# EAGLE design board_final (EAGLE 7.6.0)
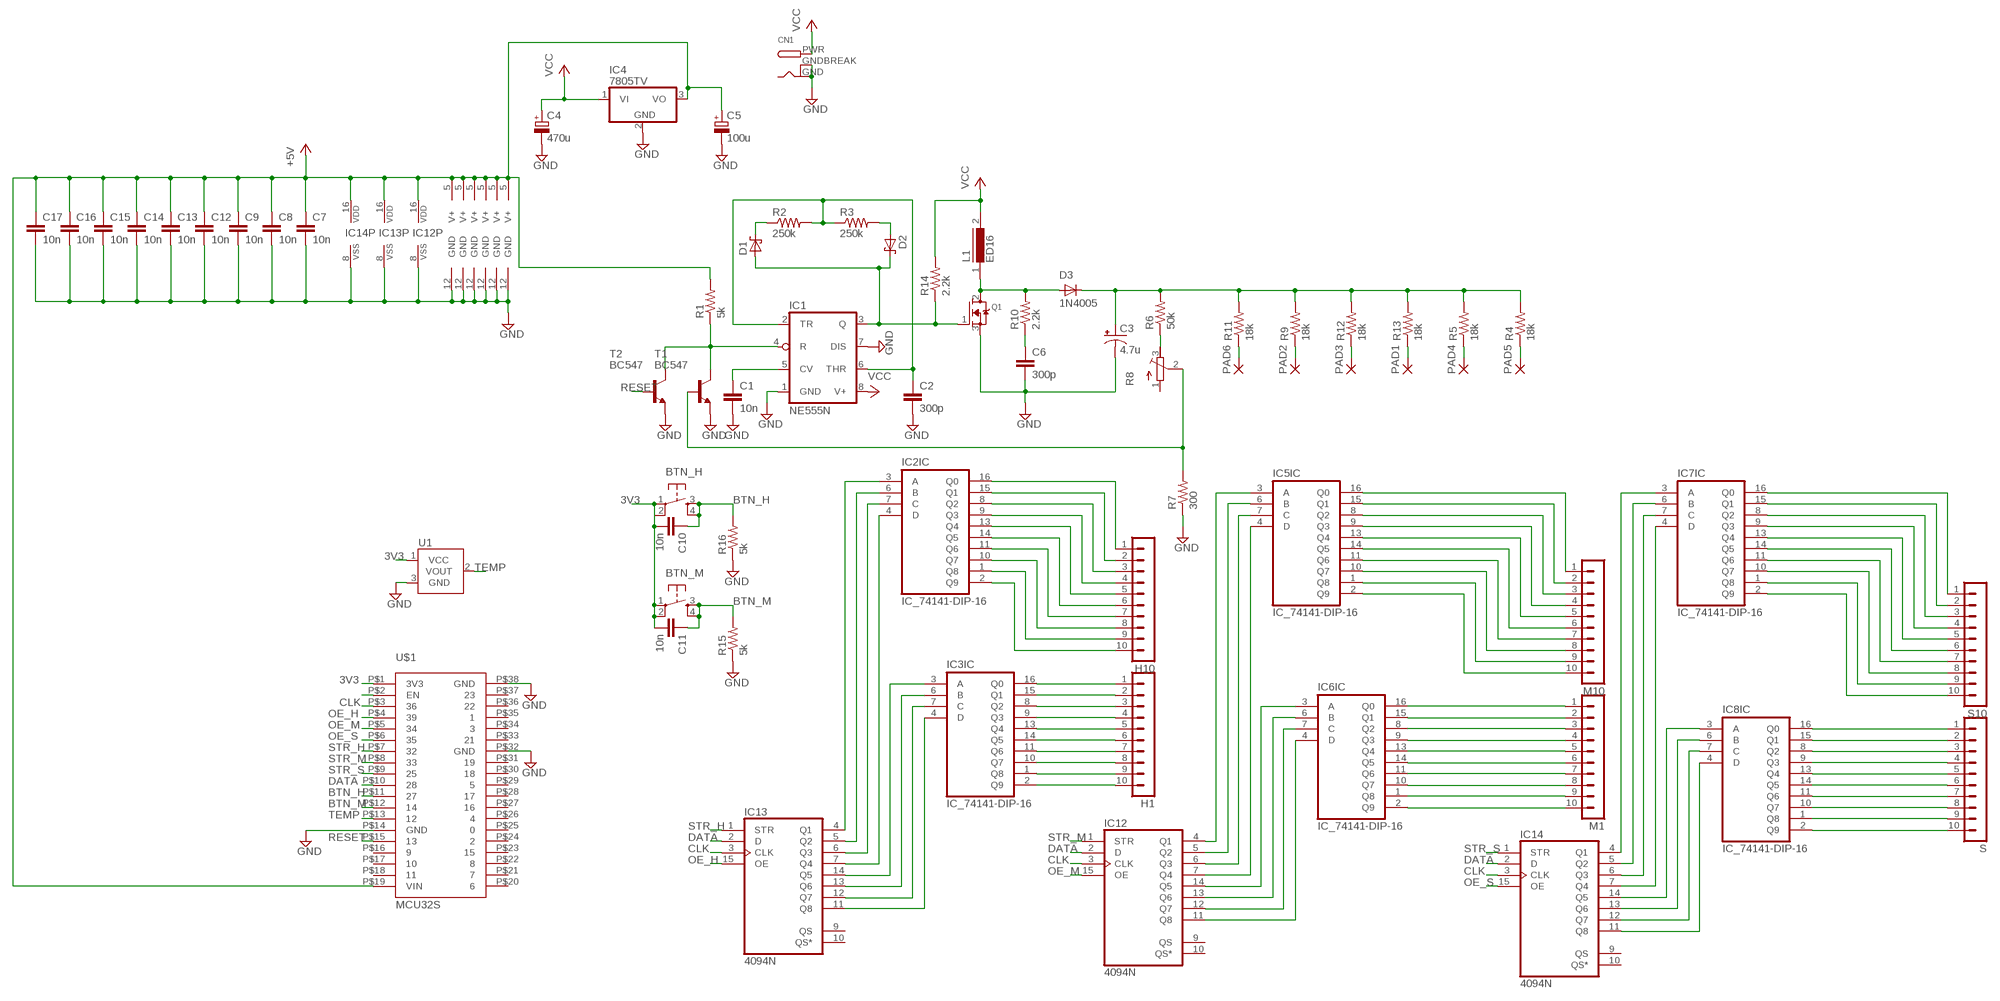
[diagram p0: schematic, sheet 1]

## Parts
BTN_H  TAC_SWITCHPTH  [TACTILE-PTH]
BTN_M  TAC_SWITCHPTH  [TACTILE-PTH]
C1  10n  C-EU050-030X075  [C050-030X075]
C2  300p  C-EU050-030X075  [C050-030X075]
C3  4.7u  CPOL-USE3.5-10  [E3,5-10]
C4  470u  CPOL-EUE5-8.5  [E5-8,5]
C5  100u  CPOL-EUE5-8.5  [E5-8,5]
C6  300p  C-EU050-030X075  [C050-030X075]
C7  10n  C-EU050-030X075  [C050-030X075]
C8  10n  C-EU050-030X075  [C050-030X075]
C9  10n  C-EU050-030X075  [C050-030X075]
C10  10n  C-EU050-030X075  [C050-030X075]
C11  10n  C-EU050-030X075  [C050-030X075]
C12  10n  C-EU050-030X075  [C050-030X075]
C13  10n  C-EU050-030X075  [C050-030X075]
C14  10n  C-EU050-030X075  [C050-030X075]
C15  10n  C-EU050-030X075  [C050-030X075]
C16  10n  C-EU050-030X075  [C050-030X075]
C17  10n  C-EU050-030X075  [C050-030X075]
CN1  DCBARRELPTH  [DCJACK_2MM_PTH]
D1  SCHOTTKY-DIODEF126Z12  [F126Z12]
D2  SCHOTTKY-DIODEF126Z12  [F126Z12]
D3  1N4005  [DO41-10]
H1  MA10-1  [MA10-1]
H10  MA10-1  [MA10-1]
IC1  NE555N  [DIL08]
IC2  IC_74141-DIP-16  [DIL16]
IC3  IC_74141-DIP-16  [DIL16]
IC4  7805TV  [TO220V]
IC5  IC_74141-DIP-16  [DIL16]
IC6  IC_74141-DIP-16  [DIL16]
IC7  IC_74141-DIP-16  [DIL16]
IC8  IC_74141-DIP-16  [DIL16]
IC12  4094N  [DIL16]
IC13  4094N  [DIL16]
IC14  4094N  [DIL16]
L1  ED16  [ED16]
M1  MA10-1  [MA10-1]
M10  MA10-1  [MA10-1]
PAD1  3,17/1,3  [3,17/1,3]
PAD2  3,17/1,3  [3,17/1,3]
PAD3  3,17/1,3  [3,17/1,3]
PAD4  3,17/1,3  [3,17/1,3]
PAD5  3,17/1,3  [3,17/1,3]
PAD6  3,17/1,3  [3,17/1,3]
Q1  MOSFET-NGDS_TO220V  [TO220V]
R1  5k  R-US_0207/10  [0207/10]
R2  250k  R-US_0207/10  [0207/10]
R3  250k  R-US_0207/10  [0207/10]
R4  18k  R-US_0207/10  [0207/10]
R5  18k  R-US_0207/10  [0207/10]
R6  50k  R-US_0207/10  [0207/10]
R7  300  R-US_0207/10  [0207/10]
R8  R-TRIMM3296W  [RTRIM3296W]
R9  18k  R-US_0207/10  [0207/10]
R10  2.2k  R-US_0207/10  [0207/10]
R11  18k  R-US_0207/10  [0207/10]
R12  18k  R-US_0207/10  [0207/10]
R13  18k  R-US_0207/10  [0207/10]
R14  2.2k  R-US_0207/10  [0207/10]
R15  5k  R-US_0207/10  [0207/10]
R16  5k  R-US_0207/10  [0207/10]
S  MA10-1  [MA10-1]
S10  MA10-1  [MA10-1]
T1  BC547  [TO92]
T2  BC547  [TO92]
U1  TMP36GT9  [TO-92]
U$1  MCU32S  [NODEMCU32S]

## Nets
3V3: BTN_H.1 BTN_H.2 BTN_M.1 BTN_M.2 C10.2 C11.2 U1.1(VCC) U$1.P$1(3V3)
BTN_H: BTN_H.3 BTN_H.4 C10.1 R16.2 U$1.P$11
BTN_M: BTN_M.3 BTN_M.4 C11.1 R15.2 U$1.P$12
CLK: IC12.3(CLK) IC13.3(CLK) IC14.3(CLK) U$1.P$3
DATA: IC12.2(D) IC13.2(D) IC14.2(D) U$1.P$10
GND: C1.2 C2.2 C3.- C4.- C5.- C6.2 C7.2 C8.2 C9.2 C12.2 C13.2 C14.2 C15.2 C16.2 C17.2 CN1.GND CN1.GNDBREAK IC1.1(GND) IC1.7(DIS) IC2.12(SUPPLY:GND) IC3.12(SUPPLY:GND) IC4.2(GND) IC5.12(SUPPLY:GND) IC6.12(SUPPLY:GND) IC7.12(SUPPLY:GND) IC8.12(SUPPLY:GND) IC12.8(VSS) IC13.8(VSS) IC14.8(VSS) Q1.3(S) R7.1 R15.1 R16.1 T1.1(E) T2.1(E) U1.3(GND) U$1.P$14(GND) U$1.P$32(GND) U$1.P$38(GND)
N$1: C1.1 IC1.5(CV)
N$2: C2.1 IC1.2(TR) IC1.6(THR) R2.2 R3.1
N$3: C3.+ D3.C R4.2 R5.2 R6.2 R9.2 R11.2 R12.2 R13.2
N$4: D1.A D2.C IC1.3(Q) Q1.1(G) R14.1
N$5: IC1.4(R) R1.1 T1.3(C) T2.3(C)
N$6: H10.1 IC2.16(IC:Q0)
N$7: D2.A R3.2
N$8: D1.C R2.1
N$9: IC2.3(IC:A) IC13.4(Q1)
N$10: D3.A L1.1 Q1.2(D) R10.2
N$11: H10.2 IC2.15(IC:Q1)
N$12: H10.3 IC2.8(IC:Q2)
N$13: H10.4 IC2.9(IC:Q3)
N$14: H10.5 IC2.13(IC:Q4)
N$15: H10.6 IC2.14(IC:Q5)
N$16: H10.7 IC2.11(IC:Q6)
N$17: H10.8 IC2.10(IC:Q7)
N$18: H10.9 IC2.1(IC:Q8)
N$19: H10.10 IC2.2(IC:Q9)
N$20: PAD6.1(P) R11.1
N$21: IC2.7(IC:C) IC13.6(Q3)
N$22: IC2.6(IC:B) IC13.5(Q2)
N$23: IC2.4(IC:D) IC13.7(Q4)
N$24: H1.1 IC3.16(IC:Q0)
N$25: H1.2 IC3.15(IC:Q1)
N$26: H1.3 IC3.8(IC:Q2)
N$27: C6.1 R10.1
N$28: H1.4 IC3.9(IC:Q3)
N$29: H1.5 IC3.13(IC:Q4)
N$30: H1.6 IC3.14(IC:Q5)
N$31: H1.7 IC3.11(IC:Q6)
N$32: R6.1 R8.3(E)
N$33: R7.2 R8.2(S) T1.2(B)
N$34: H1.8 IC3.10(IC:Q7)
N$35: H1.9 IC3.1(IC:Q8)
N$36: H1.10 IC3.2(IC:Q9)
N$37: IC3.7(IC:C) IC13.12(Q7)
N$38: IC3.6(IC:B) IC13.13(Q6)
N$39: IC3.4(IC:D) IC13.11(Q8)
N$40: PAD2.1(P) R9.1
N$41: IC3.3(IC:A) IC13.14(Q5)
N$42: IC6.2(IC:Q9) M1.10
N$43: IC6.1(IC:Q8) M1.9
N$44: IC6.10(IC:Q7) M1.8
N$45: IC6.11(IC:Q6) M1.7
N$46: IC6.14(IC:Q5) M1.6
N$47: IC6.13(IC:Q4) M1.5
N$48: IC6.9(IC:Q3) M1.4
N$49: IC6.8(IC:Q2) M1.3
N$50: IC6.15(IC:Q1) M1.2
N$51: IC6.16(IC:Q0) M1.1
N$52: IC5.7(IC:C) IC12.6(Q3)
N$53: IC5.6(IC:B) IC12.5(Q2)
N$54: IC5.4(IC:D) IC12.7(Q4)
N$55: PAD3.1(P) R12.1
N$56: IC5.3(IC:A) IC12.4(Q1)
N$57: IC5.16(IC:Q0) M10.1
N$58: IC5.15(IC:Q1) M10.2
N$59: IC5.8(IC:Q2) M10.3
N$60: IC5.9(IC:Q3) M10.4
N$61: IC5.13(IC:Q4) M10.5
N$62: IC5.14(IC:Q5) M10.6
N$63: IC5.11(IC:Q6) M10.7
N$64: IC5.10(IC:Q7) M10.8
N$65: IC5.1(IC:Q8) M10.9
N$66: IC5.2(IC:Q9) M10.10
N$67: IC6.6(IC:B) IC12.13(Q6)
N$68: IC8.16(IC:Q0) S.1
N$69: IC8.15(IC:Q1) S.2
N$70: PAD1.1(P) R13.1
N$71: IC6.3(IC:A) IC12.14(Q5)
N$72: IC7.3(IC:A) IC14.4(Q1)
N$73: IC8.8(IC:Q2) S.3
N$74: IC8.9(IC:Q3) S.4
N$75: IC8.13(IC:Q4) S.5
N$76: IC8.14(IC:Q5) S.6
N$77: IC8.11(IC:Q6) S.7
N$78: IC8.10(IC:Q7) S.8
N$79: IC8.2(IC:Q9) S.10
N$80: IC8.1(IC:Q8) S.9
N$81: IC7.16(IC:Q0) S10.1
N$82: IC7.6(IC:B) IC14.5(Q2)
N$83: IC7.7(IC:C) IC14.6(Q3)
N$84: IC7.4(IC:D) IC14.7(Q4)
N$85: PAD4.1(P) R5.1
N$86: IC8.3(IC:A) IC14.14(Q5)
N$87: IC8.6(IC:B) IC14.13(Q6)
N$88: IC7.15(IC:Q1) S10.2
N$89: IC7.8(IC:Q2) S10.3
N$90: IC7.9(IC:Q3) S10.4
N$91: IC7.13(IC:Q4) S10.5
N$92: IC7.14(IC:Q5) S10.6
N$93: IC7.11(IC:Q6) S10.7
N$94: IC7.10(IC:Q7) S10.8
N$95: IC7.1(IC:Q8) S10.9
N$96: IC7.2(IC:Q9) S10.10
N$97: IC8.7(IC:C) IC14.12(Q7)
N$98: IC8.4(IC:D) IC14.11(Q8)
N$99: PAD5.1(P) R4.1
N$100: IC6.7(IC:C) IC12.12(Q7)
N$101: U$1.P$2(EN)
N$102: IC6.4(IC:D) IC12.11(Q8)
OE_H: IC13.15(OE) U$1.P$4
OE_M: IC12.15(OE) U$1.P$5
OE_S: IC14.15(OE) U$1.P$6
RESET: T2.2(B) U$1.P$15
STR_H: IC13.1(STR) U$1.P$7
STR_M: IC12.1(STR) U$1.P$8
STR_S: IC14.1(STR) U$1.P$9
TEMP: U1.2(VOUT) U$1.P$13
V+: C5.+ C7.1 C8.1 C9.1 C12.1 C13.1 C14.1 C15.1 C16.1 C17.1 IC2.5(SUPPLY:V+) IC3.5(SUPPLY:V+) IC4.3(VO) IC5.5(SUPPLY:V+) IC6.5(SUPPLY:V+) IC7.5(SUPPLY:V+) IC8.5(SUPPLY:V+) IC12.16(VDD) IC13.16(VDD) IC14.16(VDD) R1.2 U$1.P$19(VIN) ; supply symbol labelled +5V
VCC: C4.+ CN1.PWR IC1.8(V+) IC4.1(VI) L1.2 R14.2
Unconnected: IC12.9(QS) IC12.10(QS*) IC13.9(QS) IC13.10(QS*) IC14.9(QS) IC14.10(QS*) R8.1(A) U$1.P$16 U$1.P$17 U$1.P$18 U$1.P$20 U$1.P$21 U$1.P$22 U$1.P$23 U$1.P$24 U$1.P$25 U$1.P$26 U$1.P$27 U$1.P$28 U$1.P$29 U$1.P$30 U$1.P$31 U$1.P$33 U$1.P$34 U$1.P$35 U$1.P$36 U$1.P$37

## Library data of the parts
BTN_H BTN_M = SparkFun:TAC_SWITCH: Momentary Switch Button commonly used for reset or general input. Spark Fun Electronics SKU : COM-00097
C1 C2 C6-C17 = rcl:C-EU: CAPACITOR, European symbol
C3 = adafruit:CPOL-US: POLARIZED CAPACITOR, American symbol
C4 C5 = rcl:CPOL-EU: POLARIZED CAPACITOR, European symbol
CN1 = adafruit:DCBARREL: 2.0mm DC Barrel Jack DCJACK_2MM_PTH - Through Hole Jack (4UConnector: 05537)
D1 D2 = adafruit:SCHOTTKY-DIODE: Schottky Diode
D3 = diode:1N4005
H1 H10 M1 M10 S S10 = con-lstb:MA10-1: PIN HEADER; OC_FARNELL: unknown; OC_NEWARK: unknown
IC1 = linear:*555: TIMER
IC2 IC3 IC5-IC8 = dp_devices:IC_74141: BCD to decimal decoder
IC4 = linear:78*: Positive VOLTAGE REGULATOR Source: http://cache.national.com/ds/LM/LM78L05.pdf http://www.fairchildsemi.com/ds/LM/LM7805.pdf
IC12-IC14 = 40xx:4094: 8-stage SHIFT/STORE REGISTER, tri-state
L1 = inductors:ED16: INDUCTOR
PAD1-PAD6 = wirepad:3,17/1,3: THROUGH-HOLE PAD
Q1 = adafruit:MOSFET-N: N-Channel Mosfet 2N7002E - 60V 260mA SOT23 [Digikey: 2N7002ET1GOSTR-ND] - REEL BSH103 - 30V 850mA SOT23 [Digikey: 568-5013-1-ND]
R1-R7 R9-R16 = rcl:R-US_: RESISTOR, American symbol
R8 = resistor:R-TRIMM: Trimm resistor
T1 T2 = transistor:BC547: NPN TRANSISTOR
U1 = SparkFun:TMP36
U$1 = nodeMCU:MCU32S

## Board
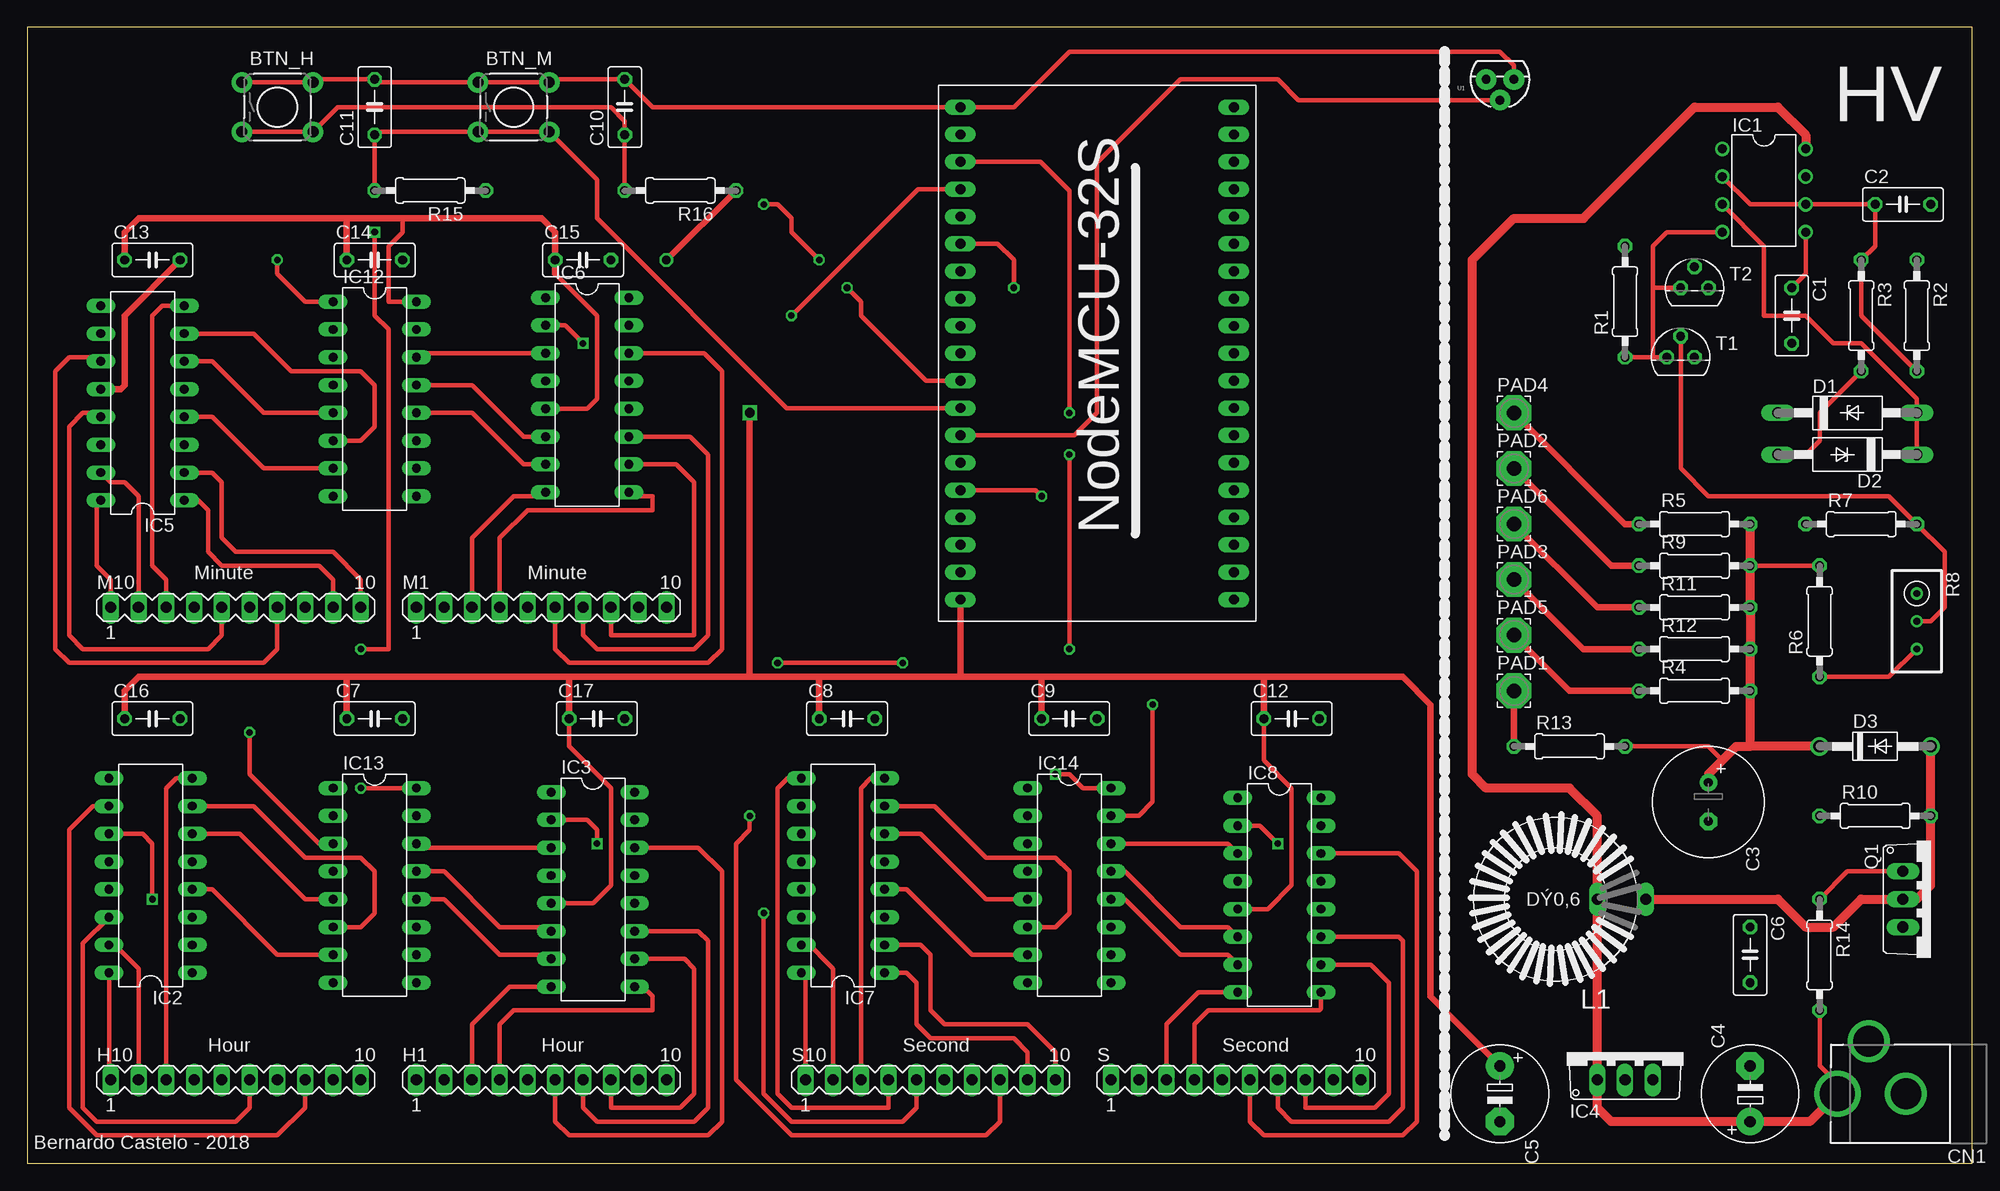
[diagram p1: board, top side]
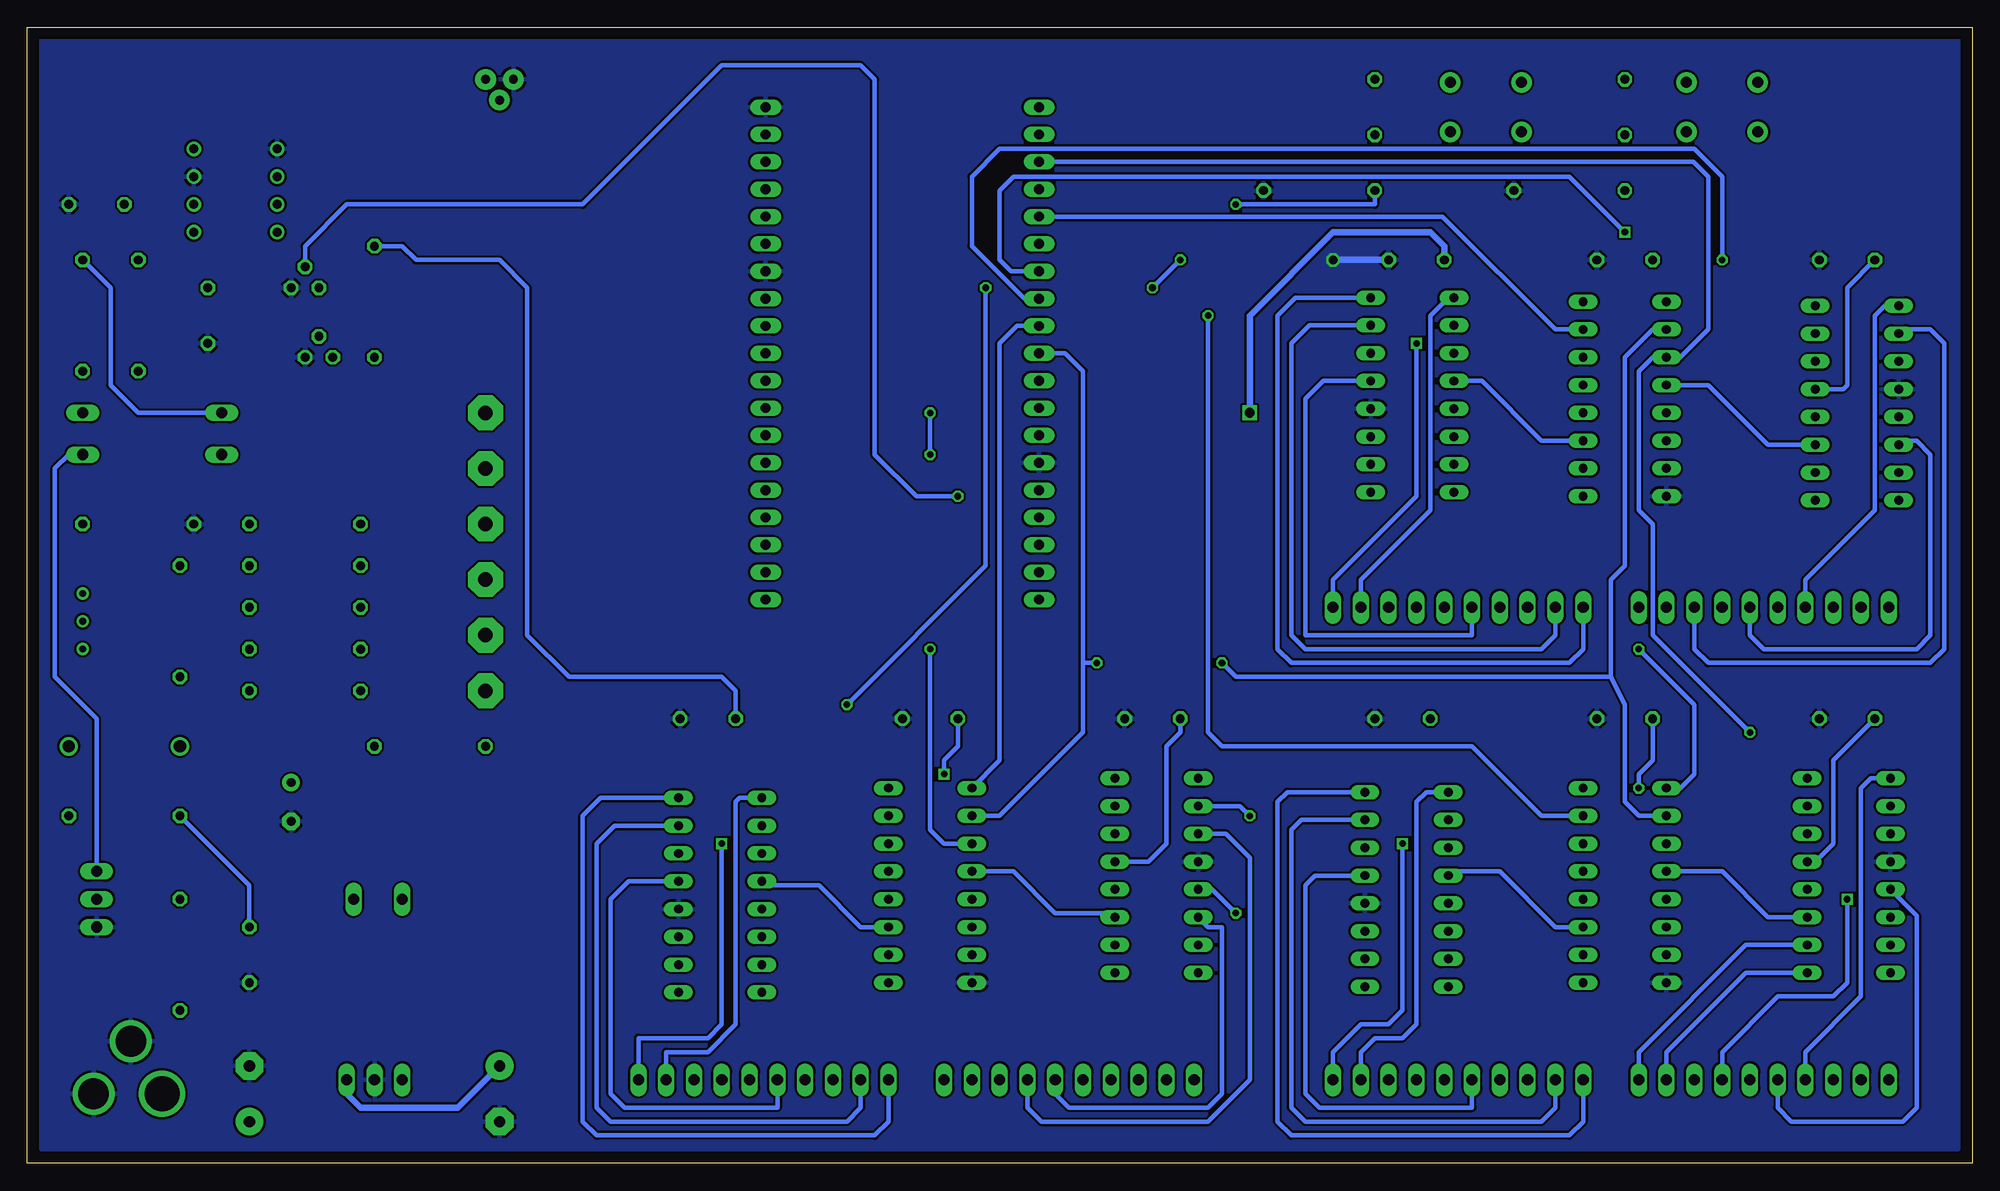
[diagram p2: board, bottom side, seen from below]

Size 177.78 x 103.81 mm. Coordinates in mm from the lower left corner, seen from the top.
Outline: 0,0 177.78,0 177.78,103.81 0,103.81 0,0
Copper layers (1*16): Top 0.035mm / dielectric 1.5mm / Bottom 0.035mm
Design rules "default *": minimum track width 3.5mil, minimum drill 0.2mm, track to track 8mil, track to pad 8mil, pad to pad 8mil, via to via 8mil, smd to smd 8mil, copper to edge 40mil, drill to drill 0.2mm, minimum pad ring 10mil, minimum via ring 8mil, stop-mask expansion 4mil, vias tented up to drill 0mil, thermal gap 10mil

### Footprints (pad centres in the part's own frame; a part is rotated, then mirrored left to right if it is on the bottom)
TACTILE-PTH = drill 1.016 pad 1.88: 1 -3.251,2.261; 2 3.251,2.261; 3 -3.251,-2.261; 4 3.251,-2.261
C050-030X075 = drill 0.813 octagon: 1 -2.54,0; 2 2.54,0
E3,5-10 = drill 0.813 pad 1.6: + -1.778,0 | drill 0.813 pad 1.6 octagon: - 1.778,0
E5-8,5 = drill 1.016 pad 2.54: + -2.54,0 | drill 1.016 pad 2.54 octagon: - 2.54,0
DCJACK_2MM_PTH = drill 2.8: GND 0,7.35; GNDBREAK 4.8,10.75 | drill 3.2: PWR 0,13.6
F126Z12 = drill 1.016 long: A 6.35,0; C -6.35,0
DO41-10 = drill 1.118: A 5.08,0; C -5.08,0
MA10-1 = drill 1.016 long: 1 -11.43,0; 2 -8.89,0; 3 -6.35,0; 4 -3.81,0; 5 -1.27,0; 6 1.27,0; 7 3.81,0; 8 6.35,0; 9 8.89,0; 10 11.43,0
DIL08 = drill 0.813 pad 1.27: 1 -3.81,-3.81; 2 -1.27,-3.81; 3 1.27,-3.81; 4 3.81,-3.81; 5 3.81,3.81; 6 1.27,3.81; 7 -1.27,3.81; 8 -3.81,3.81
DIL16 = drill 0.813 long: 1 -8.89,-3.81; 2 -6.35,-3.81; 3 -3.81,-3.81; 4 -1.27,-3.81; 5 1.27,-3.81; 6 3.81,-3.81; 7 6.35,-3.81; 8 8.89,-3.81; 9 8.89,3.81; 10 6.35,3.81; 11 3.81,3.81; 12 1.27,3.81; 13 -1.27,3.81; 14 -3.81,3.81; 15 -6.35,3.81; 16 -8.89,3.81
TO220V = drill 1.016 long: 1 -2.54,-2.54; 2 0,-2.54; 3 2.54,-2.54
ED16 = drill 1.016 long: 1 -8.255,0; 2 -3.81,0
3,17/1,3 = drill 1.321 pad 3.175 octagon: 1 0,0
0207/10 = drill 0.813 octagon: 1 -5.08,0; 2 5.08,0
RTRIM3296W = drill 0.61: 1 0,-2.54; 2 0,0; 3 0,2.54
TO92 = drill 0.813 octagon: 1 1.27,0; 2 0,1.905; 3 -1.27,0
TO-92 = drill 0.813 pad 1.88: 1 -1.27,0; 2 0,1.905; 3 1.27,0
NODEMCU32S = drill 0.9 pad 1.422 long: P$1 -12.5,0; P$2 -12.5,-2.5; P$3 -12.5,-5; P$4 -12.5,-7.5; P$5 -12.5,-10; P$6 -12.5,-12.5; P$7 -12.5,-15; P$8 -12.5,-17.5; P$9 -12.5,-20; P$10 -12.5,-22.5; P$11 -12.5,-25; P$12 -12.5,-27.5; P$13 -12.5,-30; P$14 -12.5,-32.5; P$15 -12.5,-35; P$16 -12.5,-37.5; P$17 -12.5,-40; P$18 -12.5,-42.5; P$19 -12.5,-45; P$20 12.5,-45; P$21 12.5,-42.5; P$22 12.5,-40; P$23 12.5,-37.5; P$24 12.5,-35; P$25 12.5,-32.5; P$26 12.5,-30; P$27 12.5,-27.5; P$28 12.5,-25; P$29 12.5,-22.5; P$30 12.5,-20; P$31 12.5,-17.5; P$32 12.5,-15; P$33 12.5,-12.5; P$34 12.5,-10; P$35 12.5,-7.5; P$36 12.5,-5; P$37 12.5,-2.5; P$38 12.5,0

### Placement (x,y rotation side)
BTN_H  22.86,96.52 0 top
BTN_M  44.45,96.52 0 top
C1  161.29,77.47 270 top
C2  171.45,87.63 0 top
C3  153.67,33.02 270 top
C4  157.48,6.35 90 top
C5  134.62,6.35 270 top
C6  157.48,19.05 270 top
C7  31.75,40.64 0 top
C8  74.93,40.64 0 top
C9  95.25,40.64 0 top
C10  54.61,96.52 90 top
C11  31.75,96.52 90 top
C12  115.57,40.64 0 top
C13  11.43,82.55 0 top
C14  31.75,82.55 0 top
C15  50.8,82.55 0 top
C16  11.43,40.64 0 top
C17  52.07,40.64 0 top
CN1  179.07,6.35 90 top
D1  166.37,68.58 0 top
D2  166.37,64.77 180 top
D3  168.91,38.1 0 top
H1  46.99,7.62 0 top
H10  19.05,7.62 0 top
IC1  158.75,88.9 270 top
IC2  11.28,26.3 90 top
IC3  51.7,25.03 270 top
IC4  146.05,10.16 0 top
IC5  10.53,69.48 90 top
IC6  51.17,70.22 270 top
IC7  74.56,26.3 90 top
IC8  114.45,24.5 270 top
IC12  31.75,69.85 270 top
IC13  31.75,25.4 270 top
IC14  95.25,25.4 270 top
L1  139.7,24.13 180 top
M1  46.99,50.8 0 top
M10  19.05,50.8 0 top
PAD1  135.89,43.18 0 top
PAD2  135.89,63.5 0 top
PAD3  135.89,53.34 0 top
PAD4  135.89,68.58 0 top
PAD5  135.89,48.26 0 top
PAD6  135.89,58.42 0 top
Q1  173.99,24.13 270 top
R1  146.05,78.74 90 top
R2  172.72,77.47 270 top
R3  167.64,77.47 270 top
R4  152.4,43.18 0 top
R5  152.4,58.42 0 top
R6  163.83,49.53 90 top
R7  167.64,58.42 0 top
R8  172.72,49.53 180 top
R9  152.4,54.61 0 top
R10  168.91,31.75 0 top
R11  152.4,50.8 0 top
R12  152.4,46.99 0 top
R13  140.97,38.1 0 top
R14  163.83,19.05 270 top
R15  36.83,88.9 180 top
R16  59.69,88.9 180 top
S  110.49,7.62 0 top
S10  82.55,7.62 0 top
T1  151.13,73.66 0 top
T2  152.4,80.01 0 top
U1  134.62,99.06 180 top
U$1  97.79,96.52 0 top

### Tracks (layer width: path | path; a pad name or v marks a point on that pad's centre or on a via)
3V3
  Top 0.406: BTN_H.1 BTN_H.2 26.39,99.06 C11.2 32.03,98.78 BTN_M.1 BTN_M.2 47.98,99.06 C10.2 57.15,96.52 U$1.P$1 90.17,96.52 95.25,101.6 134.62,101.6 135.89,100.33 U1.1
BTN_H  (via drill 0.6)
  Top 0.406: BTN_H.3 BTN_H.4 28.37,96.52 53.34,96.52 54.61,95.25 C10.1 R16.2 | v67.31,87.63 68.58,87.63 69.85,86.36 69.85,85.09 v72.39,82.55 | v74.93,80.01 76.2,78.74 76.2,77.47 82.15,71.52 U$1.P$11
  Bottom 0.406: R16.2 54.61,87.63 v67.31,87.63 | v72.39,82.55 v74.93,80.01
BTN_M
  Top 0.406: R15.2 C11.1 32.03,94.26 BTN_M.3 BTN_M.4 52.07,89.89 52.07,86.36 69.41,69.02 U$1.P$12
CLK  (via drill 0.6)
  Top 0.406: v95.25,46.99 v95.25,64.77 | v95.25,68.58 95.25,88.9 92.63,91.52 U$1.P$3 | IC13.3 26.67,29.21 20.32,35.56 v20.32,39.37
  Bottom 0.406: U$1.P$3 25.48,91.52 24.13,90.17 24.13,76.2 26.67,73.66 IC12.3 29.21,73.66 30.48,72.39 30.48,59.69 29.21,58.42 29.21,48.26 v20.32,39.37 | IC14.3 93.98,29.21 95.25,30.48 v95.25,46.99 | v95.25,64.77 v95.25,68.58
DATA  (via drill 0.6)
  Top 0.406: v80.01,45.72 v68.58,45.72
  Bottom 0.406: IC12.2 29.21,76.2 31.75,73.66 31.75,54.61 33.02,53.34 33.02,44.45 | IC13.2 30.48,31.75 31.75,33.02 31.75,41.91 33.02,44.45 | 33.02,44.45 67.31,44.45 v68.58,45.72 | IC14.2 88.9,31.75 81.28,39.37 81.28,45.72 | 81.28,45.72 81.28,72.39 82.91,74.02 U$1.P$10 | 81.28,45.72 v80.01,45.72
GND  (via drill 0.8)
  Top 0.61: v58.42,82.55 R16.1 | IC5.12 8.52,70.75 8.89,71.12 8.89,77.47 C13.2
  Bottom 0.61: C15.2 v58.42,82.55
  pour Bottom: 1.27,102.87 176.53,102.87 176.53,1.27 1.27,1.27
N$1
  Top 0.406: C1.1 162.56,81.28 IC1.5
N$2
  Top 0.406: IC1.2 157.48,87.63 IC1.6 C2.1 168.91,83.82 R3.1 167.64,77.47 R2.2
N$3
  Top 0.406: R6.2 R9.2 | 154.94,36.83 153.67,38.1 R13.2
  Top 0.813: D3.C 157.48,38.1 | C3.+ 153.67,35.56 154.94,36.83 156.21,38.1 157.48,38.1 | 157.48,38.1 R4.2 R12.2 R11.2 R9.2 R5.2
N$4
  Top 0.406: R14.1 166.37,26.67 Q1.1 | D2.C D1.A 172.72,69.85 167.64,74.93 165.1,74.93 162.56,77.47 158.75,77.47 158.75,83.82 IC1.3
  Bottom 0.406: Q1.1 171.45,40.64 175.26,44.45 175.26,63.5 173.99,64.77 D2.C
N$5
  Top 0.406: T1.3 148.59,73.66 | 148.59,73.66 R1.1 | IC1.4 149.86,85.09 148.59,83.82 148.59,80.01 | 148.59,80.01 148.59,73.66 | T2.3 148.59,80.01
N$6
  Top 0.406: 7.62,17.25 IC2.16 7.47,7.62 H10.1
N$7
  Top 0.406: R3.2 163.83,68.58 163.83,66.04 162.56,64.77 D2.A
N$8
  Bottom 0.406: R2.1 170.18,80.01 170.18,71.12 167.64,68.58 D1.C
N$9
  Bottom 0.406: IC2.3 18.68,22.49 22.86,26.67 IC13.4
N$10
  Top 0.813: L1.1 160.02,24.13 162.56,21.59 165.1,21.59 167.64,24.13 Q1.2 172.72,24.13 173.99,25.4 R10.2 D3.A
N$11
  Top 0.406: IC2.15 7.99,19.95 10.16,17.78 H10.2
N$12
  Top 0.406: IC2.8 13.6,35.19 12.7,34.29 H10.3
N$13
  Bottom 0.406: IC2.9 9.26,35.19 10.16,34.29 10.16,15.24 15.24,10.16 H10.4
N$14
  Bottom 0.406: IC2.13 5.08,22.64 5.08,5.08 6.35,3.81 16.51,3.81 17.78,5.08 H10.5
N$15
  Top 0.406: IC2.14 5.08,20.1 5.08,5.08 6.35,3.81 19.05,3.81 20.32,5.08 H10.6
N$16  (via drill 0.6)
  Top 0.406: v11.43,24.13 11.43,29.21 10.53,30.11 IC2.11
  Bottom 0.406: v11.43,24.13 11.43,16.51 12.7,15.24 17.78,15.24 22.86,10.16 H10.7
N$17
  Top 0.406: IC2.10 5.98,32.65 3.81,30.48 3.81,5.08 6.35,2.54 22.86,2.54 25.4,5.08 H10.8
N$18
  Bottom 0.406: IC2.1 20.69,17.41 27.94,10.16 H10.9
N$19
  Bottom 0.406: IC2.2 20.69,19.95 30.48,10.16 H10.10
N$20
  Top 0.61: R11.1 143.51,50.8 PAD6.1
N$21
  Top 0.406: IC2.7 20.69,32.65 25.4,27.94 30.48,27.94 31.75,26.67 31.75,22.86 30.48,21.59 IC13.6
N$22
  Top 0.406: IC2.6 19.42,30.11 25.4,24.13 IC13.5
N$23
  Top 0.406: IC2.4 16.88,25.03 22.86,19.05 IC13.7
N$24
  Bottom 0.406: IC3.16 62.6,33.92 63.5,33.02 63.5,3.81 62.23,2.54 36.83,2.54 35.56,3.81 H1.1
N$25
  Bottom 0.406: IC3.15 61.33,31.38 62.23,30.48 62.23,5.08 60.96,3.81 39.37,3.81 38.1,5.08 H1.2
N$26
  Top 0.406: IC3.8 44.08,16.14 40.64,12.7 H1.3
N$27
  Bottom 0.406: R10.1 157.48,25.4 C6.1
N$28
  Top 0.406: IC3.9 56.25,16.14 57.15,15.24 57.15,13.97 44.45,13.97 43.18,12.7 H1.4
N$29
  Bottom 0.406: IC3.13 60.06,26.3 60.96,25.4 60.96,6.35 59.69,5.08 45.72,5.08 H1.5
N$30
  Top 0.406: IC3.14 61.33,28.84 63.5,26.67 63.5,3.81 62.23,2.54 49.53,2.54 48.26,3.81 H1.6
N$31
  Top 0.406: IC3.11 61.33,21.22 62.23,20.32 62.23,5.08 60.96,3.81 52.07,3.81 50.8,5.08 H1.7
N$32
  Top 0.406: R8.3 170.18,44.45 R6.1
N$33
  Top 0.406: R8.2 173.99,49.53 175.26,50.8 175.26,55.88 R7.2 170.18,60.96 153.67,60.96 151.13,63.5 T1.2
N$34
  Top 0.406: IC3.10 60.06,18.68 60.96,17.78 60.96,6.35 59.69,5.08 53.34,5.08 H1.8
N$35
  Bottom 0.406: H1.9 55.88,10.16 54.61,11.43 52.07,11.43 50.8,12.7 50.8,33.02 49.9,33.92 IC3.1
N$36  (via drill 0.6)
  Top 0.406: v52.07,29.21 52.07,30.48 51.17,31.38 IC3.2
  Bottom 0.406: H1.10 58.42,10.16 55.88,12.7 53.34,12.7 52.07,13.97 v52.07,29.21
N$37
  Top 0.406: IC3.7 47.52,19.05 43.18,19.05 38.1,24.13 IC13.12
N$38
  Top 0.406: IC3.6 47.52,21.59 43.18,21.59 38.1,26.67 IC13.13
N$39
  Bottom 0.406: IC3.4 47.52,26.67 43.18,26.67 38.1,21.59 IC13.11
N$40
  Top 0.61: R9.1 144.78,54.61 PAD2.1
N$41
  Top 0.406: IC13.14 35.93,28.84 IC3.3
N$42  (via drill 0.6)
  Top 0.406: v50.8,74.93 49.16,76.57 IC6.2
  Bottom 0.406: M1.10 58.42,53.34 50.8,60.96 v50.8,74.93
N$43
  Bottom 0.406: M1.9 55.88,53.34 49.53,59.69 49.53,77.47 47.89,79.11 IC6.1
N$44
  Top 0.406: M1.8 53.34,48.26 60.96,48.26 60.96,62.23 59.32,63.87 IC6.10
N$45
  Top 0.406: M1.7 50.8,48.26 52.07,46.99 60.96,46.99 62.23,48.26 62.23,64.77 60.59,66.41 IC6.11
N$46
  Top 0.406: M1.6 48.26,46.99 49.53,45.72 62.23,45.72 63.5,46.99 63.5,72.39 61.86,74.03 IC6.14
N$47
  Bottom 0.406: M1.5 45.72,48.26 60.96,48.26 60.96,69.85 59.32,71.49 IC6.13
N$48
  Top 0.406: M1.4 43.18,57.15 45.72,59.69 57.15,59.69 57.15,60.96 55.35,60.96 IC6.9
N$49
  Top 0.406: M1.3 40.64,57.15 44.45,60.96 46.99,60.96 IC6.8
N$50
  Bottom 0.406: M1.2 38.1,48.26 39.37,46.99 60.96,46.99 62.23,48.26 62.23,74.93 60.59,76.57 IC6.15
N$51
  Bottom 0.406: M1.1 35.56,46.99 36.83,45.72 62.23,45.72 63.5,46.99 63.5,77.47 61.86,79.11 IC6.16
N$52
  Top 0.406: IC5.7 20.69,75.83 24.13,72.39 30.48,72.39 31.75,71.12 31.75,67.31 30.48,66.04 IC12.6
N$53
  Top 0.406: IC5.6 16.88,73.29 21.59,68.58 IC12.5
N$54
  Top 0.406: IC12.7 21.59,63.5 16.88,68.21 IC5.4
N$55
  Top 0.61: R12.1 142.24,46.99 PAD3.1
N$56
  Bottom 0.406: IC5.3 18.68,65.67 24.13,71.12 IC12.4
N$57
  Top 0.406: IC5.16 6.35,60.22 6.35,54.61 7.62,53.34 M10.1
N$58
  Top 0.406: IC5.15 7.62,62.23 8.89,62.23 10.16,60.96 M10.2
N$59
  Top 0.406: M10.3 12.7,53.34 11.43,54.61 11.43,77.47 12.33,78.37 IC5.8
N$60
  Bottom 0.406: M10.4 15.24,53.34 8.89,59.69 8.89,77.47 7.99,78.37 IC5.9
N$61
  Top 0.406: IC5.13 6.35,68.58 5.08,68.58 3.81,67.31 3.81,48.26 5.08,46.99 16.51,46.99 17.78,48.26 M10.5
N$62
  Bottom 0.406: IC5.14 6.35,66.04 5.08,66.04 3.81,64.77 3.81,48.26 5.08,46.99 19.05,46.99 20.32,48.26 M10.6
N$63
  Top 0.406: IC5.11 6.35,73.66 3.81,73.66 2.54,72.39 2.54,46.99 3.81,45.72 21.59,45.72 22.86,46.99 M10.7
N$64
  Bottom 0.406: IC5.10 6.35,76.2 3.81,76.2 2.54,74.93 2.54,46.99 3.81,45.72 24.13,45.72 25.4,46.99 M10.8
N$65
  Top 0.406: M10.9 27.94,53.34 26.67,54.61 17.78,54.61 16.51,55.88 16.51,59.69 15.61,60.59 IC5.1
N$66
  Top 0.406: M10.10 30.48,53.34 27.94,55.88 19.05,55.88 17.78,57.15 17.78,62.23 16.88,63.13 IC5.2
N$67
  Top 0.406: IC12.13 40.64,71.12 45.35,66.41 IC6.6
N$68
  Bottom 0.406: IC8.16 125.36,33.39 127,31.75 127,3.81 125.73,2.54 100.33,2.54 99.06,3.81 S.1
N$69
  Bottom 0.406: IC8.15 124.09,30.85 125.73,29.21 125.73,5.08 124.46,3.81 102.87,3.81 101.6,5.08 S.2
N$70
  Top 0.61: R13.1 PAD1.1
N$71
  Top 0.406: IC12.14 35.93,74.03 IC6.3
N$72
  Bottom 0.406: IC7.3 78.74,22.86 83.82,22.86 87.63,26.67 IC14.4
N$73
  Top 0.406: IC8.8 107.05,15.61 104.14,12.7 S.3
N$74
  Top 0.406: IC8.9 118.26,14.12 118.11,13.97 107.95,13.97 106.68,12.7 S.4
N$75
  Bottom 0.406: IC8.13 122.82,25.77 124.46,24.13 124.46,6.35 123.19,5.08 109.22,5.08 S.5
N$76
  Top 0.406: IC8.14 125.36,28.31 127,26.67 127,3.81 125.73,2.54 113.03,2.54 111.76,3.81 S.6
N$77
  Top 0.406: IC8.11 125.36,20.69 125.73,20.32 125.73,5.08 124.46,3.81 115.57,3.81 114.3,5.08 S.7
N$78
  Top 0.406: IC8.10 122.82,18.15 124.46,16.51 124.46,6.35 123.19,5.08 116.84,5.08 S.8
N$79  (via drill 0.6)
  Top 0.406: v114.3,29.21 112.66,30.85 IC8.2
  Bottom 0.406: S.10 121.92,11.43 115.57,11.43 114.3,12.7 v114.3,29.21
N$80
  Bottom 0.406: S.9 119.38,10.16 115.57,10.16 113.03,12.7 113.03,33.02 112.66,33.39 IC8.1
N$81
  Top 0.406: 71.12,17.04 IC7.16 71.12,17.41 S10.1
N$82
  Top 0.406: IC7.6 81.65,30.11 87.63,24.13 IC14.5
N$83
  Top 0.406: IC7.7 82.92,32.65 87.63,27.94 93.98,27.94 95.25,26.67 95.25,22.86 93.98,21.59 IC14.6
N$84
  Top 0.406: IC14.7 86.36,19.05 80.38,25.03 IC7.4
N$85
  Top 0.61: R5.1 146.05,58.42 PAD4.1
N$86
  Top 0.406: IC8.3 109.75,29.21 IC14.14
N$87
  Top 0.406: IC8.6 109.75,21.59 105.41,21.59 100.33,26.67 IC14.13
N$88
  Top 0.406: IC7.15 71.12,20.32 73.66,17.78 S10.2
N$89
  Top 0.406: IC7.8 77.1,35.19 76.2,34.29 S10.3
N$90
  Top 0.406: IC7.9 69.48,35.19 68.58,34.29 68.58,6.35 69.85,5.08 78.74,5.08 S10.4
N$91  (via drill 0.6)
  Top 0.406: v67.31,22.86 67.31,6.35 69.85,3.81 80.01,3.81 81.28,5.08 S10.5
  Bottom 0.406: v67.31,22.86 69.48,25.03 IC7.13
N$92
  Bottom 0.406: IC7.14 69.85,21.59 68.58,21.59 68.58,6.35 69.85,5.08 82.55,5.08 83.82,6.35 S10.6
N$93
  Bottom 0.406: IC7.11 68.21,30.11 66.04,27.94 66.04,7.62 69.85,3.81 85.09,3.81 86.36,5.08 S10.7
N$94  (via drill 0.6)
  Top 0.406: v66.04,31.75 66.04,30.48 64.77,29.21 64.77,7.62 69.85,2.54 87.63,2.54 88.9,3.81 S10.8
  Bottom 0.406: v66.04,31.75 66.94,32.65 IC7.10
N$95
  Top 0.406: IC7.1 80.38,17.41 81.28,16.51 81.28,12.7 82.55,11.43 90.17,11.43 91.44,10.16 S10.9
N$96
  Top 0.406: IC7.2 81.65,19.95 82.55,19.05 82.55,13.97 83.82,12.7 91.44,12.7 93.98,10.16 S10.10
N$97
  Top 0.406: IC8.7 109.75,19.05 105.41,19.05 100.33,24.13 IC14.12
N$98
  Bottom 0.406: IC8.4 110.27,25.4 105.41,25.4 101.6,21.59 IC14.11
N$99
  Top 0.61: R4.1 140.97,43.18 PAD5.1
N$100
  Top 0.406: IC6.7 45.35,63.87 40.64,68.58 IC12.12
N$102
  Bottom 0.406: IC12.11 39.37,66.04 44.82,71.49 IC6.4
OE_H  (via drill 0.6)
  Top 0.406: U$1.P$4 81.4,89.02 v69.85,77.47
  Bottom 0.406: v69.85,77.47 69.85,39.37 68.58,38.1 45.72,38.1 39.37,31.75 IC13.15
OE_M
  Bottom 0.406: U$1.P$5 48.42,86.52 38.1,76.2 IC12.15
OE_S  (via drill 0.6)
  Top 0.406: v90.17,80.01 90.17,82.55 88.7,84.02 U$1.P$6 | IC14.15 101.6,31.75 102.87,33.02 v102.87,41.91
  Bottom 0.406: v90.17,80.01 90.17,54.61 v102.87,41.91
RESET  (via drill 0.6)
  Top 0.406: U$1.P$15 92.15,61.52 v92.71,60.96
  Bottom 0.406: v92.71,60.96 96.52,60.96 100.33,64.77 100.33,99.06 101.6,100.33 114.3,100.33 127,87.63 148.59,87.63 152.4,83.82 T2.2
STR_H  (via drill 0.6)
  Top 0.406: v30.48,46.99 33.02,46.99 33.02,76.2 31.75,77.47 v31.75,85.09
  Bottom 0.406: IC13.1 26.67,34.29 25.4,35.56 25.4,41.91 v30.48,46.99 | v31.75,85.09 36.83,90.17 87.63,90.17 88.9,88.9 88.9,82.55 87.87,81.52 U$1.P$7
STR_M  (via drill 0.6)
  Top 0.406: IC12.1 25.4,78.74 22.86,81.28 v22.86,82.55
  Bottom 0.406: v22.86,82.55 22.86,90.17 25.4,92.71 88.9,92.71 91.44,90.17 91.44,83.82 86.64,79.02 U$1.P$8
STR_S
  Bottom 0.406: IC14.1 88.9,36.83 88.9,74.93 87.31,76.52 U$1.P$9
TEMP
  Top 0.406: U1.2 116.2,97.16 114.3,99.06 105.41,99.06 97.79,91.44 97.79,68.58 95.73,66.52 U$1.P$13
V+  (via drill 0.6, 0.9)
  Top 0.406: 48.26,81.28 52.07,77.47 52.07,69.85 51.17,68.95 IC6.5 | IC3.5 51.7,23.76 53.34,25.4 53.34,34.29 49.53,38.1 C17.1 | IC8.5 113.4,23.23 115.57,25.4 115.57,34.29 113.03,36.83 C12.1 | IC13.16 v30.48,34.29 | IC14.16 96.52,34.29 95.25,35.56 v93.98,35.56 | IC12.16 33.02,78.74 33.02,83.82 34.29,85.09 34.29,86.36
  Top 0.61: 29.21,86.36 10.16,86.36 8.89,85.09 C13.1 | 48.26,81.28 C15.1 48.26,85.09 46.99,86.36 34.29,86.36 29.21,86.36 | 29.21,86.36 C14.1 | C5.+ 128.27,15.24 128.27,41.91 125.73,44.45 113.03,44.45 | 113.03,44.45 92.71,44.45 | 92.71,44.45 85.09,44.45 | 85.09,44.45 72.39,44.45 | 49.53,44.45 29.21,44.45 | 29.21,44.45 10.16,44.45 8.89,43.18 C16.1 | C7.1 29.21,44.45 | C17.1 49.53,44.45 | C8.1 72.39,44.45 | C9.1 92.71,44.45 | C12.1 113.03,44.45 | 49.53,44.45 66.04,44.45 | 72.39,44.45 66.04,44.45 | 66.04,44.45 v66.04,68.58 | U$1.P$19 85.29,44.65 85.09,44.45
  Bottom 0.406: IC5.5 11.8,70.75 11.43,71.12 11.43,80.01 C13.1 | C16.1 12.7,36.83 12.7,29.21 14.34,27.57 IC2.5 | C8.1 72.39,39.37 73.66,38.1 73.66,29.21 75.3,27.57 IC7.5 | R1.2 143.51,83.82 142.24,82.55 134.62,82.55 132.08,80.01 132.08,48.26 128.27,44.45 114.3,44.45 113.03,43.18 C12.1 | v30.48,34.29 30.48,35.56 29.21,36.83 C7.1 | C9.1 92.71,38.1 93.98,36.83 v93.98,35.56
  Bottom 0.61: C5.+ 138.43,5.08 147.32,5.08 148.59,6.35 IC4.3 | v66.04,68.58 66.04,77.47 58.42,85.09 49.53,85.09 48.26,83.82 C15.1
VCC
  Top 0.406: R14.2 163.83,8.89 165.47,7.25 CN1.PWR
  Top 0.813: CN1.PWR 162.93,3.81 C4.+ 144.78,3.81 143.51,5.08 IC4.1 L1.2 143.51,31.75 140.97,34.29 133.35,34.29 132.08,35.56 132.08,82.55 135.89,86.36 142.24,86.36 152.4,96.52 160.02,96.52 162.56,93.98 IC1.8

### Text on the board
tPlace: HV | Minute | Minute | Hour | Hour | Second | Second | Bernardo Castelo - 2018